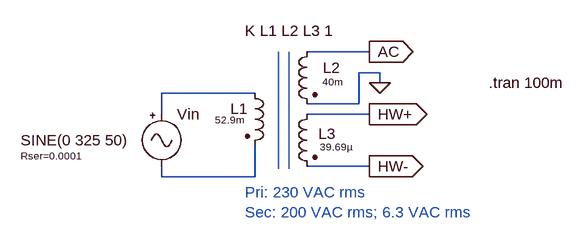
[diagram p0: schematic pt.asc]
pt.asc, the LTspice schematic file:
Version 4
SHEET 1 1076 680
WIRE 384 144 288 144
WIRE 400 176 368 176
WIRE 400 192 400 176
WIRE 208 208 64 208
WIRE 368 224 368 176
WIRE 368 224 288 224
WIRE 64 240 64 208
WIRE 384 240 288 240
WIRE 384 320 288 320
WIRE 64 336 64 320
WIRE 208 336 208 288
WIRE 208 336 64 336
FLAG 384 144 AC
IOPIN 384 144 Out
FLAG 384 240 HW+
IOPIN 384 240 Out
FLAG 400 192 0
FLAG 384 320 HW-
IOPIN 384 320 Out
SYMBOL ind2 192 192 R0
WINDOW 0 -22 40 Left 2
WINDOW 3 -46 57 Left 1
SYMATTR InstName L1
SYMATTR Value 52.9m
SYMBOL signal 64 224 R0
WINDOW 3 -217 56 Left 2
WINDOW 39 -217 80 Left 1
SYMATTR Value SINE(0 325 50)
SYMATTR InstName Vin
SYMATTR SpiceLine Rser=0.0001
SYMBOL ind2 304 128 M0
WINDOW 0 -35 41 Left 2
WINDOW 3 -39 62 Left 1
SYMATTR InstName L2
SYMATTR Value 40m
SYMBOL ind2 304 224 M0
WINDOW 0 -28 46 Left 2
WINDOW 3 -53 66 Left 1
SYMATTR InstName L3
SYMATTR Value 39.69µ
TEXT 192 112 Left 2 !K L1 L2 L3 1
TEXT 568 192 Left 2 !.tran 100m
TEXT 192 360 Left 2 ;Pri: 230 VAC rms\nSec: 200 VAC rms; 6.3 VAC rms
LINE Normal 260 144 260 324
LINE Normal 244 144 244 324

The netlist it stands for:
* pt.asc
L1 N001 N002 52.9m
Vin N001 N002 SINE(0 325 50) Rser=0.0001
L2 AC 0 40m
L3 HW+ HW- 39.69µ
K L1 L2 L3 1
.tran 100m
* Pri: 230 VAC rms
* Sec: 200 VAC rms; 6.3 VAC rms
.backanno
.end